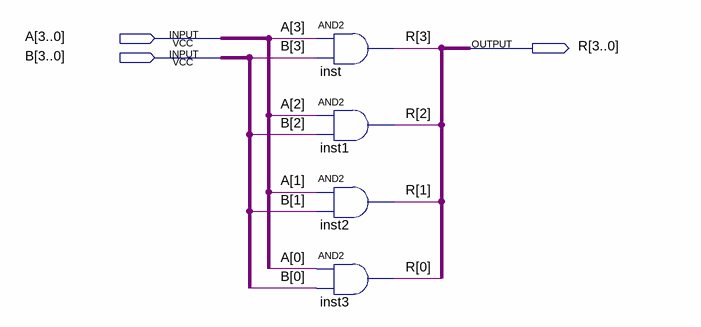
[diagram p0: schematic sheet]
// Quartus schematic AND4b.bdf as structural Verilog: 4 symbols, 3 pins
module AND4b (
  input  [3:0] A,
  input  [3:0] B,
  output [3:0] R
);

  and inst (R[3], A[3], B[3]);
  and inst1 (R[2], A[2], B[2]);
  and inst2 (R[1], A[1], B[1]);
  and inst3 (R[0], A[0], B[0]);
endmodule
